# Altium schematic sheet fpga.SchDoc
size Letter
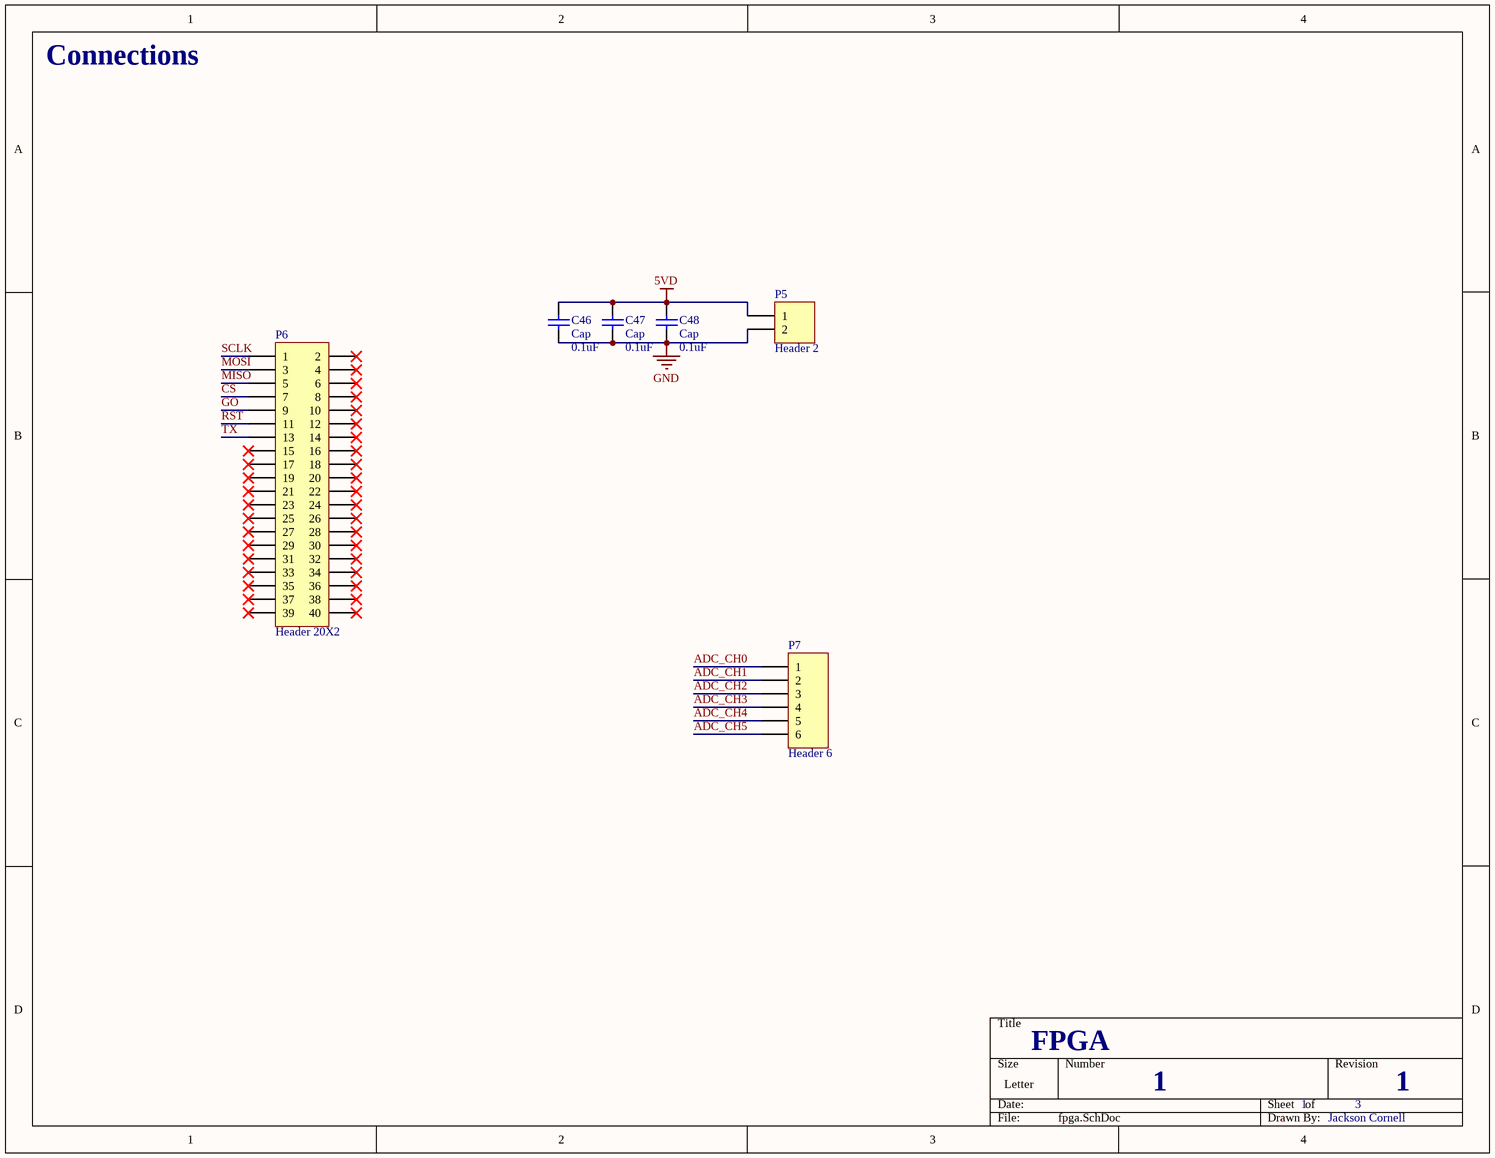
[diagram p0: fpga.SchDoc]

## Parts
C46  Cap  value 0.1uF  [CAPC0805]
C47  Cap  value 0.1uF  [CAPC0805]
C48  Cap  value 0.1uF  [CAPC0805]
P5  Header 2  [HDR1X2]
P6  Header 20X2  [HDR2X20]
P7  Header 6  [HDR1X6]

## Nets
5VD: C46.2 C47.2 C48.2 P5.1
GND: C46.1 C47.1 C48.1 P5.2
ADC_CH0: P7.1
ADC_CH1: P7.2
ADC_CH2: P7.3
ADC_CH3: P7.4
ADC_CH4: P7.5
ADC_CH5: P7.6
CS: P6.7
GO: P6.9
MISO: P6.5
MOSI: P6.3
RST: P6.11
SCLK: P6.1
TX: P6.13

Not connected (* = marked no-connect by the designer): P6 2* 4* 6* 8* 10* 12* 14* 15* 16* 17* 18* 19* 20* 21* 22* 23* 24* 25* 26* 27* 28* 29* 30* 31* 32* 33* 34* 35* 36* 37* 38* 39* 40*

## Notes on the sheet
- Connections
- FPGA
- 1
- 3
- Jackson Cornell

## Library data of the parts
C46-C48 = Cap: Capacitor; Published: 8-Jun-2000; LatestRevisionDate: 17-Jul-2002; LatestRevisionNote: Re-released for DXP Platform.; PackageReference: RAD-0.3; Publisher: Altium Limited; PackageDescription: Radial Cap, Thru-Hole; 2 Leads; 0.3 in Pin Spacing
P5 = Header 2: Header, 2-Pin; LatestRevisionDate: 17-Jul-2002; LatestRevisionNote: Re-released for DXP Platform.; Publisher: Altium Limited
P6 = Header 20X2: Header, 20-Pin, Dual row; LatestRevisionDate: 17-Jul-2002; LatestRevisionNote: Re-released for DXP Platform.; Publisher: Altium Limited
P7 = Header 6: Header, 6-Pin; LatestRevisionDate: 17-Jul-2002; LatestRevisionNote: Re-released for DXP Platform.; Publisher: Altium Limited